# EAGLE design Escon_middle_board (EAGLE 9.6.2)
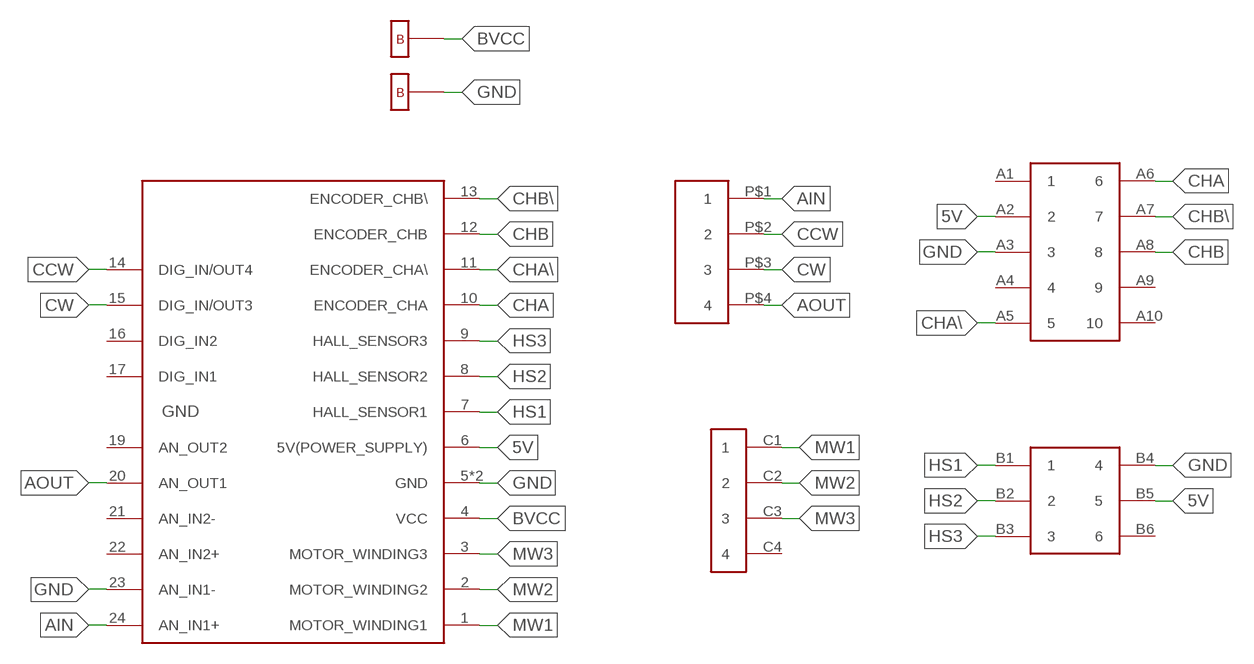
[diagram p0: schematic, sheet 1]

## Parts
U$1  ESCON24/224/2  [ESCON24/2]
U$2  280378-2CONNECTOR  [280378-2CONNECTOR]
U$3  PIN2.54-2X5  [PIN2.54-2X5]
U$4  MX-44914-0601  [MX-44914-0601]
U$5  MX5566  [MX5566]
U$6  BHOLE  [BHOLE]
U$7  BHOLE  [BHOLE]

## Nets
5V: U$1.6(5V(POWER_SUPPLY)) U$3.A2 U$4.B5
AIN: U$1.24(AN_IN1+) U$2.P$1
AOUT: U$1.20(AN_OUT1) U$2.P$4
BVCC: U$1.4(VCC) U$6.P$1
CCW: U$1.14(DIG_IN/OUT4) U$2.P$2
CHA: U$1.10(ENCODER_CHA) U$3.A6
CHA\\: U$1.11(ENCODER_CHA\\) U$3.A5
CHB: U$1.12(ENCODER_CHB) U$3.A8
CHB\\: U$1.13(ENCODER_CHB\\) U$3.A7
CW: U$1.15(DIG_IN/OUT3) U$2.P$3
GND: U$1.5(GND) U$1.18(GND) U$1.23(AN_IN1-) U$3.A3 U$4.B4 U$7.P$1
HS1: U$1.7(HALL_SENSOR1) U$4.B1
HS2: U$1.8(HALL_SENSOR2) U$4.B2
HS3: U$1.9(HALL_SENSOR3) U$4.B3
MW1: U$1.1(MOTOR_WINDING1) U$5.C1
MW2: U$1.2(MOTOR_WINDING2) U$5.C2
MW3: U$1.3(MOTOR_WINDING3) U$5.C3
Unconnected: U$1.16(DIG_IN2) U$1.17(DIG_IN1) U$1.19(AN_OUT2) U$1.21(AN_IN2-) U$1.22(AN_IN2+) U$3.A1 U$3.A4 U$3.A9 U$3.A10 U$4.B6 U$5.C4

## Library data of the parts
U$1 = ESCON_24-2:ESCON24/2
U$2 = 280378-2CONNECTOR:280378-2CONNECTOR: Signal connector: Male and Female connectors can be purchased at TME: https://www.tme.eu/gb/details/280378-2/raster-signal-connectors-2-54mm/te-connectivity/ https://www.tme.eu/gb/details/280359/raster-signal-connectors-2-54mm/te-connectivity/
U$3 = PIN2.54-2X5:PIN2.54-2X5: Connector for EC-FLAT45(encoder): Can be bought at gme.sk: https://www.gme.sk/v/1498388/kls-mlw10g-konektor-vidlice-roztec-254mm-2x5pinov-priama-do-dps
U$4 = MX-44914-0601:MX-44914-0601: Connector for EC-FLAT45(hall sensor): Can be bought trough tme.eu: https://www.tme.eu/gb/details/mx-44914-0601/other-connectors-molex/molex/449140601/
U$5 = MX5566:MX5566: Connector for EC-FLAT45(motor windings): Can be bought on gme.sk: https://www.gme.sk/v/1496575/molex-39-28-1043-mini-fit-vidlica-rozstup-42mm-2x2piny-priama-do-dps
U$6 U$7 = BATTERY_PIN:BHOLE

## Board
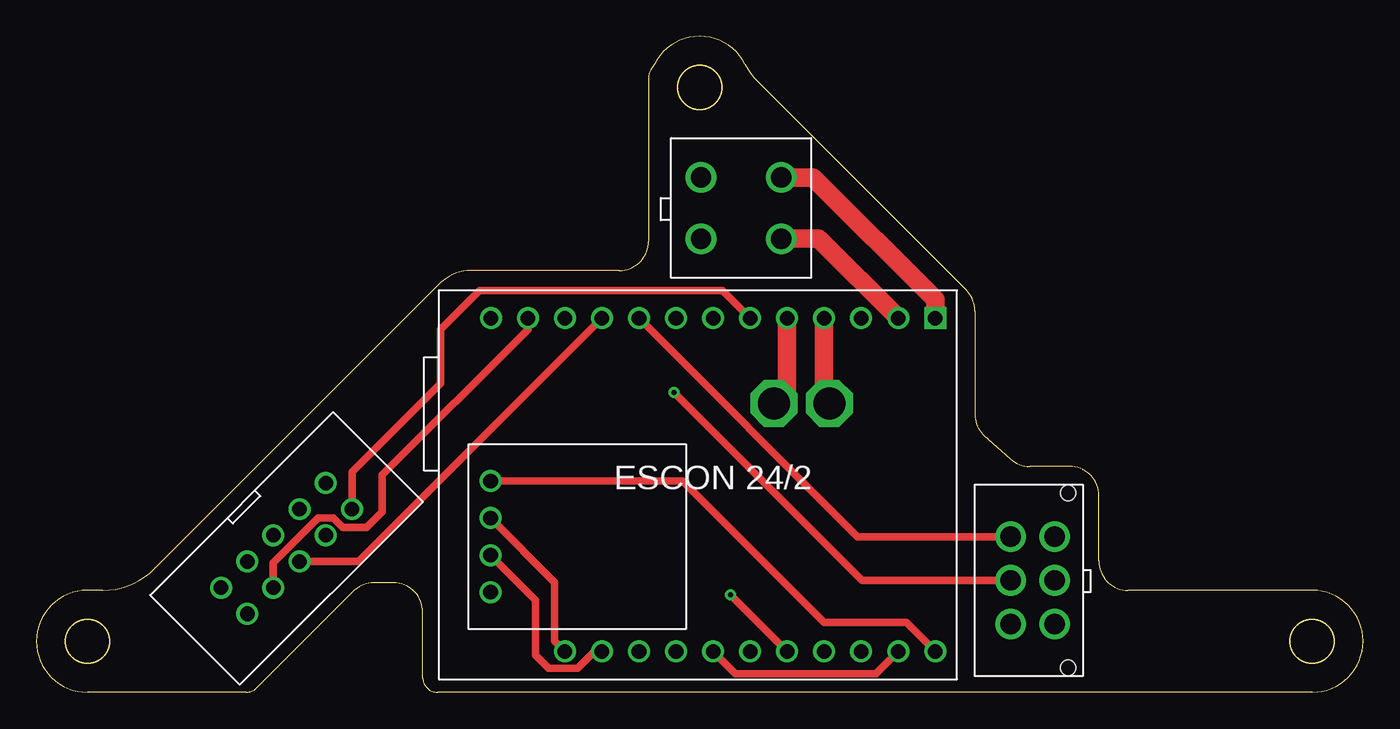
[diagram p1: board, top side]
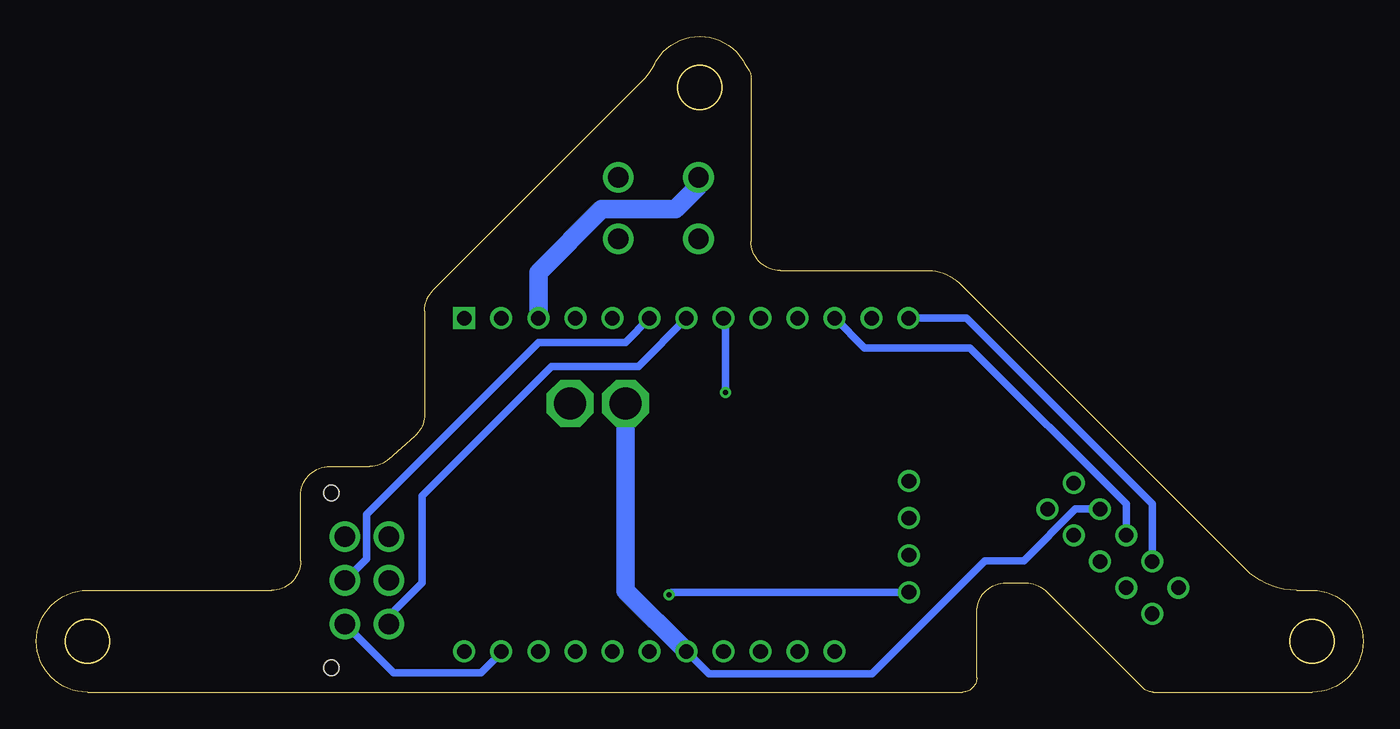
[diagram p2: board, bottom side, seen from below]

Size 91 x 45 mm. Coordinates in mm from the lower left corner, seen from the top.
Outline: 48.61,43.1 arc126 42.39,43.1 42.13,42.68 arc32 41.98,42.16 41.98,30.94 arc-90 39.98,28.94 29.81,28.94 arc45 27.69,28.06 8.09,8.46 arc-45 4.55,7 3.5,7 arc180 3.5,0 14.39,0 arc45 15.09,0.29 21.71,6.91 arc-45 23.13,7.5 24.5,7.5 arc-90 26.5,5.5 26.5,1 arc90 27.5,0 87.5,0 arc180 87.5,7 74.87,7 arc-90 72.87,9 72.87,13.5 arc90 70.87,15.5 68.14,15.5 arc-42 66.81,16.01 65.04,17.58 arc-48 64.37,19.07 64.37,26.17 arc45 63.79,27.59 49.52,41.85 arc-18 48.61,43.1
Outline: circle at 45.5,41.5 radius 1.5
Outline: circle at 87.5,3.5 radius 1.5
Outline: circle at 3.5,3.5 radius 1.5
Copper layers (1*16): Top 0.035mm / dielectric 1.5mm / Bottom 0.035mm
Design rules "default": minimum track width 6mil, minimum drill 0.35mm, track to track 6mil, track to pad 6mil, pad to pad 6mil, via to via 6mil, smd to smd 6mil, copper to edge 40mil, drill to drill 6mil, minimum pad ring 10mil, minimum via ring 8mil, stop-mask expansion 4mil, vias tented up to drill 0mil, thermal gap 10mil
Holes 1.04 mm at 70.78,13.68 70.78,1.68

### Footprints (pad centres in the part's own frame; a part is rotated, then mirrored left to right if it is on the bottom)
ESCON24/2 = drill 1 square: 1 34.06,24.765 | drill 1: 2 31.52,24.765; 3 28.98,24.765; 4 26.44,24.765; 5 23.9,24.765; 6 21.36,24.765; 7 18.82,24.765; 8 16.28,24.765; 9 13.74,24.765; 10 11.2,24.765; 11 8.66,24.765; 12 6.12,24.765; 13 3.58,24.765; 14 8.66,1.905; 15 11.2,1.905; 16 13.74,1.905; 17 16.28,1.905; 18 18.82,1.905; 19 21.36,1.905; 20 23.9,1.905; 21 26.44,1.905; 22 28.98,1.905; 23 31.52,1.905; 24 34.06,1.905
280378-2CONNECTOR = drill 1: P$1 0,0; P$2 2.54,0; P$3 5.08,0; P$4 7.62,0
PIN2.54-2X5 = drill 1: A1 0,0; A2 0,2.54; A3 2.54,0; A4 2.54,2.54; A5 5.08,0; A6 5.08,2.54; A7 7.62,0; A8 7.62,2.54; A9 10.16,0; A10 10.16,2.54
MX-44914-0601 = drill 1.4: B1 6,0; B2 3,0; B3 0,0; B4 6,3; B5 3,3; B6 0,3 | hole 1.04: -3,3.94; 9,3.94
MX5566 = drill 1.4: C1 4.2,0; C2 0,0; C3 4.2,5.5; C4 0,5.5
BHOLE = drill 2.2 octagon: P$1 0,0

### Placement (x,y rotation side)
U$1  27.59,0.9 0 top
U$2  31.15,14.49 270 top
U$3  19.85,14.36 225 top
U$4  66.84,10.68 270 top
U$5  51.09,31.12 90 top
U$6  54.39,19.82 0 top
U$7  50.58,19.82 0 top

### Tracks (layer width: path | path; a pad name or v marks a point on that pad's centre or on a via)
5V
  Top 0.508: U$1.6 47.05,27.57 30.39,27.57 27.72,24.9 27.72,21.18 21.64,15.1 U$3.A2
  Bottom 0.508: U$1.6 50.6,24.01 56.55,24.01 68.36,12.2 68.36,9.15 U$4.B5
AIN
  Top 0.508: U$1.24 59.67,4.78 54.01,4.78 44.3,14.49 U$2.P$1
AOUT  (via drill 0.35)
  Top 0.508: v47.61,6.69 U$1.20
  Bottom 0.508: U$2.P$4 47.43,6.87 v47.61,6.69
BVCC
  Top 1.27: U$6.P$1 54.03,20.18 U$1.4
CCW
  Top 0.508: U$1.14 35.54,3.51 35.54,7.55 U$2.P$2
CHA
  Top 0.508: U$3.A6 22.1,8.97 U$1.10
CHA\\
  Bottom 0.508: U$1.11 36.23,25.66 34.2,23.63 26.96,23.63 16.25,12.93 U$3.A5
CHB
  Top 0.508: U$1.12 33.71,24.9 23.72,14.91 23.72,12.39 22.64,11.31 20.99,11.31 20.35,11.95 19.34,11.95 16.25,8.86 U$3.A8
CHB\\
  Bottom 0.508: U$3.A7 14.46,12.91 27.21,25.66 U$1.13
CW
  Top 0.508: U$2.P$3 34.25,6.31 34.25,2.53 35.14,1.64 37.12,1.64 38.27,2.8 U$1.15
GND
  Top 0.508: U$1.23 57.58,1.27 47.95,1.27 U$1.18
  Top 1.27: U$7.P$1 51.49,20.73 U$1.5
  Bottom 0.508: U$1.23 59.11,2.71 60.49,1.33 66.49,1.33 U$4.B4 | U$3.A3 19.74,12.56 23.27,9.03 25.93,9.03 33.69,1.27 44.88,1.27 U$1.18
  Bottom 1.27: U$7.P$1 50.58,6.97 U$1.18
HS1
  Bottom 0.508: U$1.7 49.72,22.36 55.66,22.36 64.55,13.47 64.55,7.5 66.84,5.21 U$4.B1
HS2  (via drill 0.35)
  Top 0.508: U$4.B2 56.63,7.68 v43.72,20.58
  Bottom 0.508: v43.72,20.58 43.72,25.51 U$1.8
HS3
  Top 0.508: U$4.B3 56.32,10.68 U$1.9
MW1
  Top 1.27: U$5.C1 53.26,35.32 61.65,26.93 U$1.1
MW2
  Top 1.27: U$5.C2 53.65,31.12 U$1.2
MW3
  Bottom 1.27: U$5.C3 45.59,34.72 47.15,33.16 52.23,33.16 56.57,28.81 U$1.3